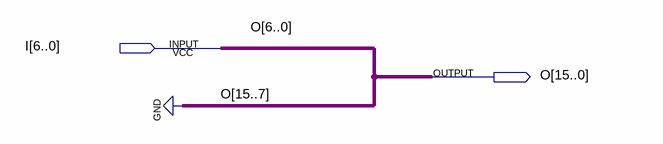
[diagram p0: schematic sheet]
// Quartus schematic extend7to16.bdf as structural Verilog: 0 symbols, 2 pins
module extend7to16 (
  input  [6:0] I,
  output [15:0] O
);


  assign O = {{9{1'b0}}, I};
endmodule
